# Altium schematic sheet 0090_USB3.SchDoc
size 848 x 558 mm
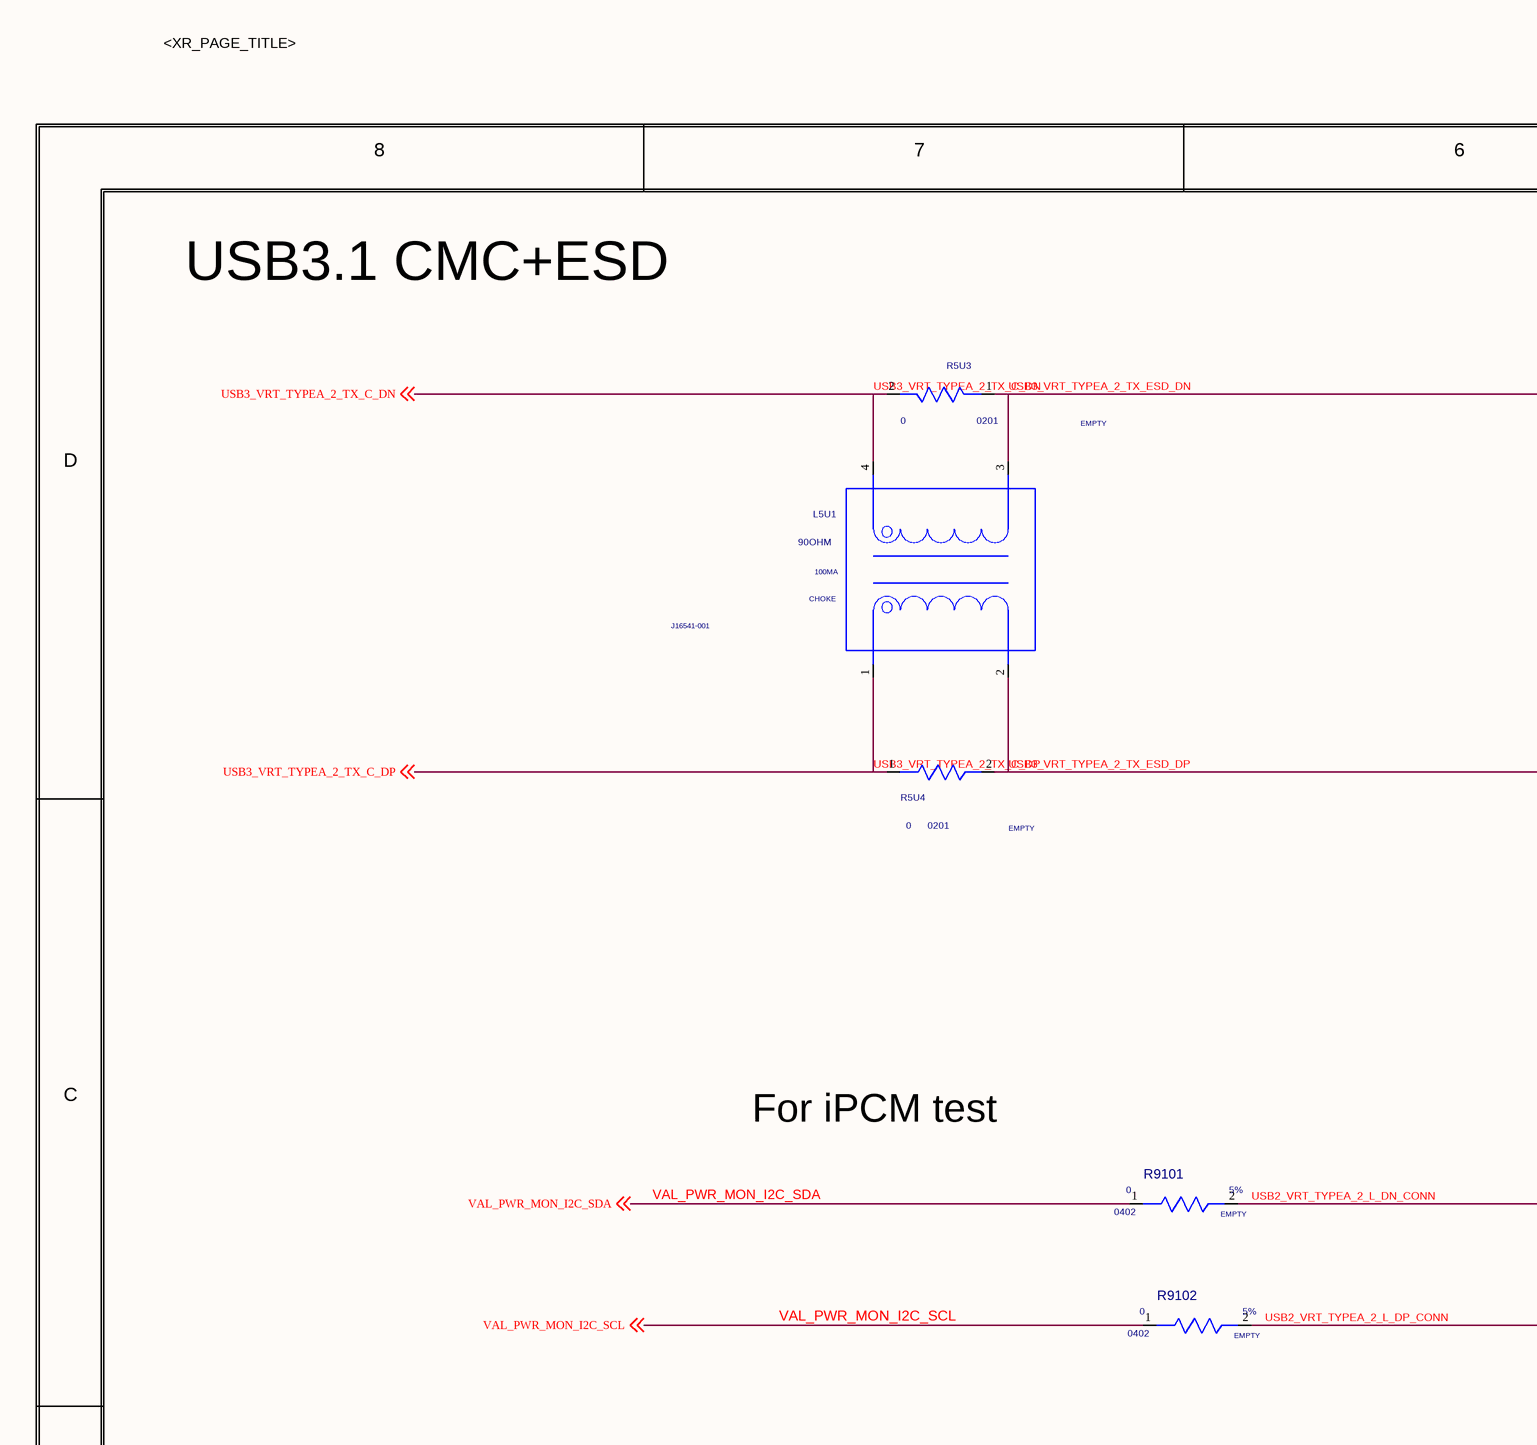
[diagram p0: 0090_USB3.SchDoc, top left]
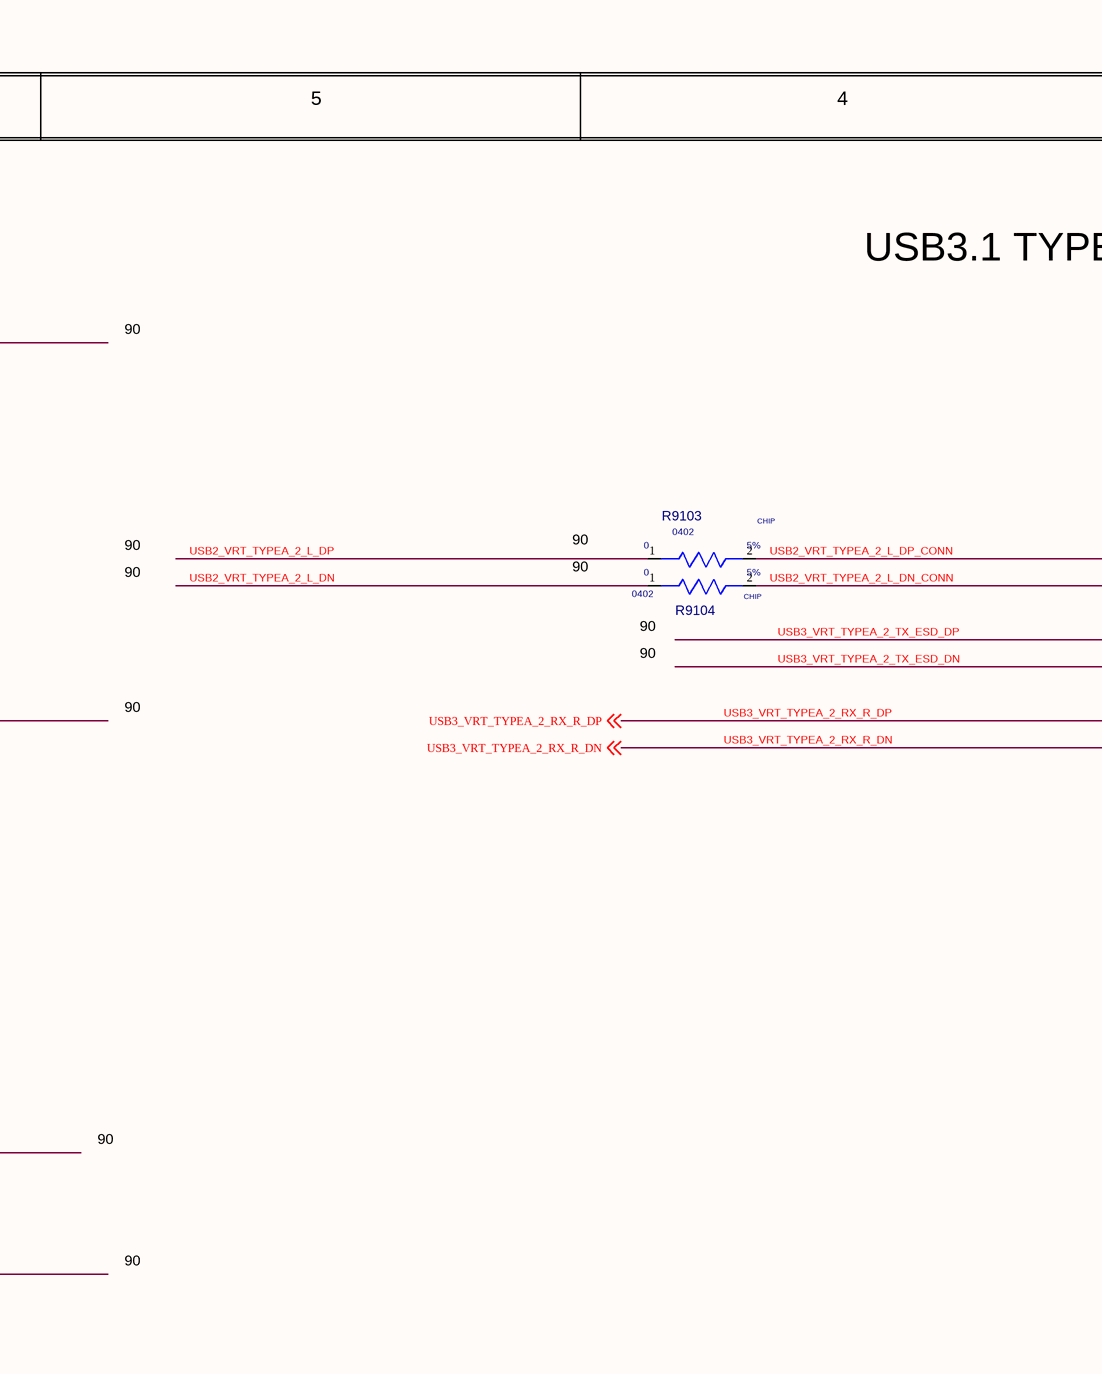
[diagram p1: 0090_USB3.SchDoc, top middle]
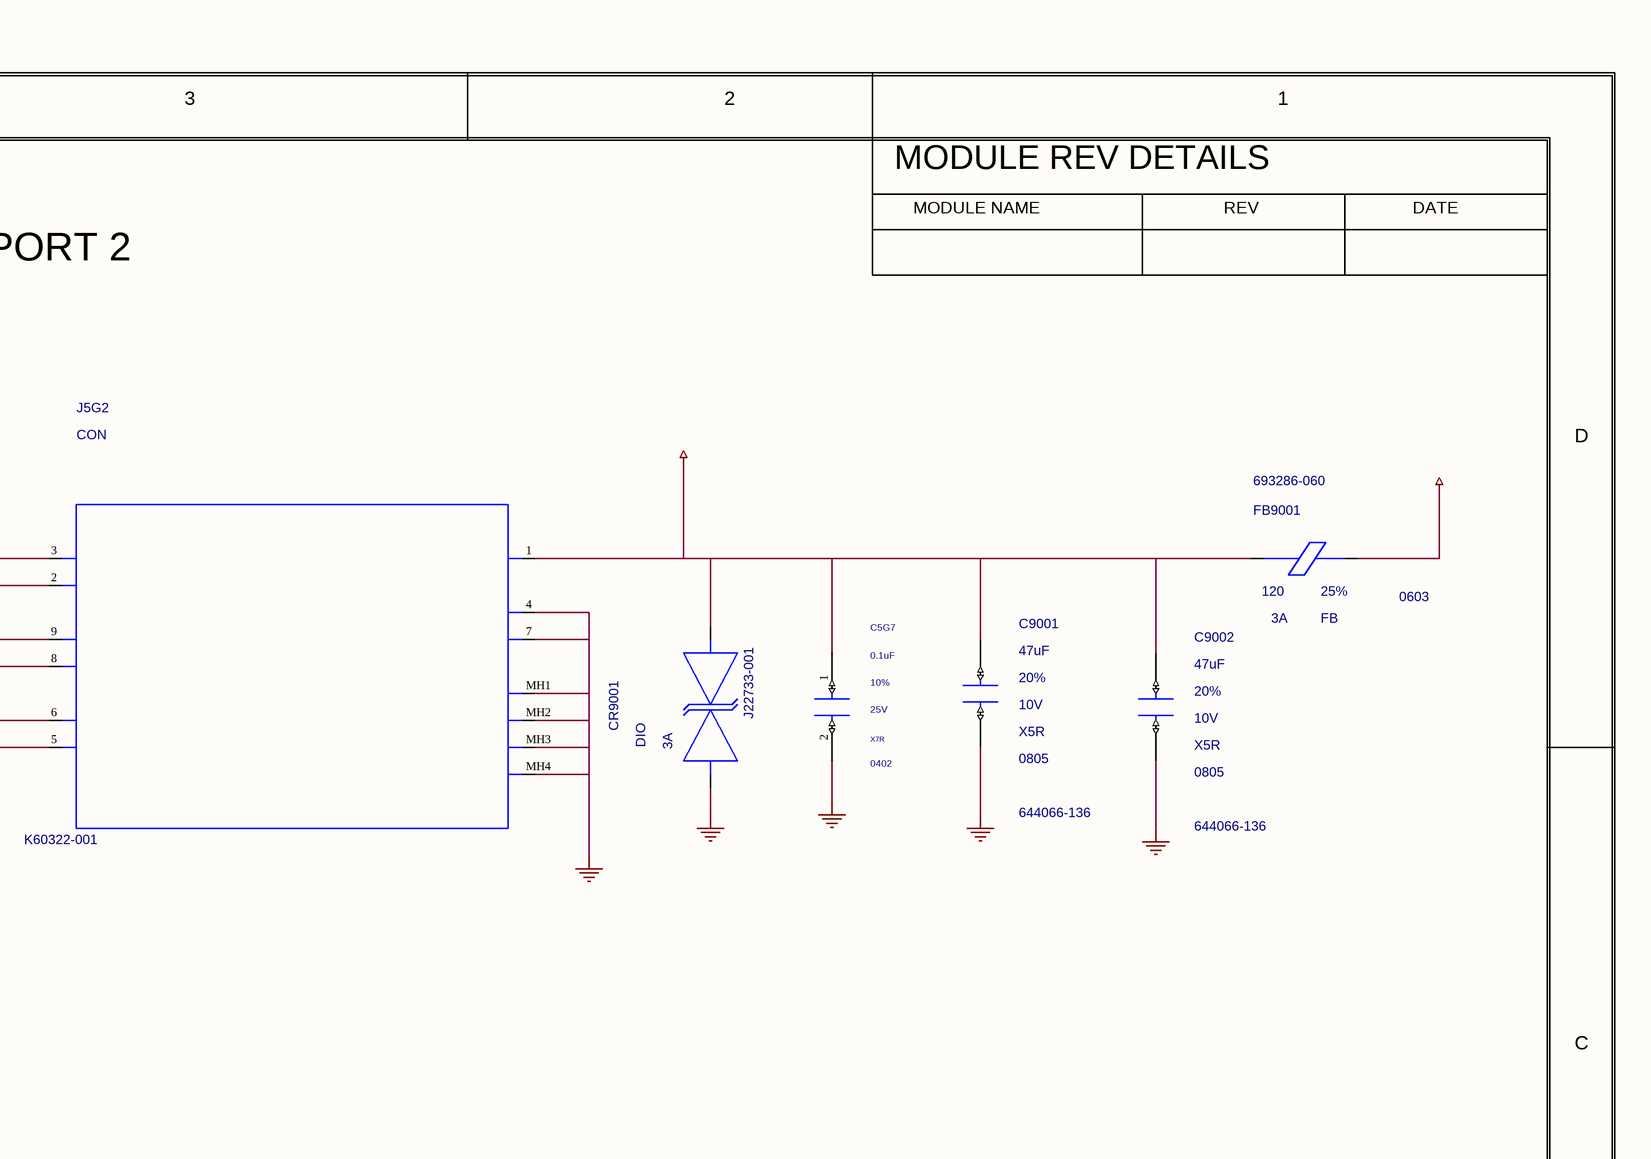
[diagram p2: 0090_USB3.SchDoc, top right]
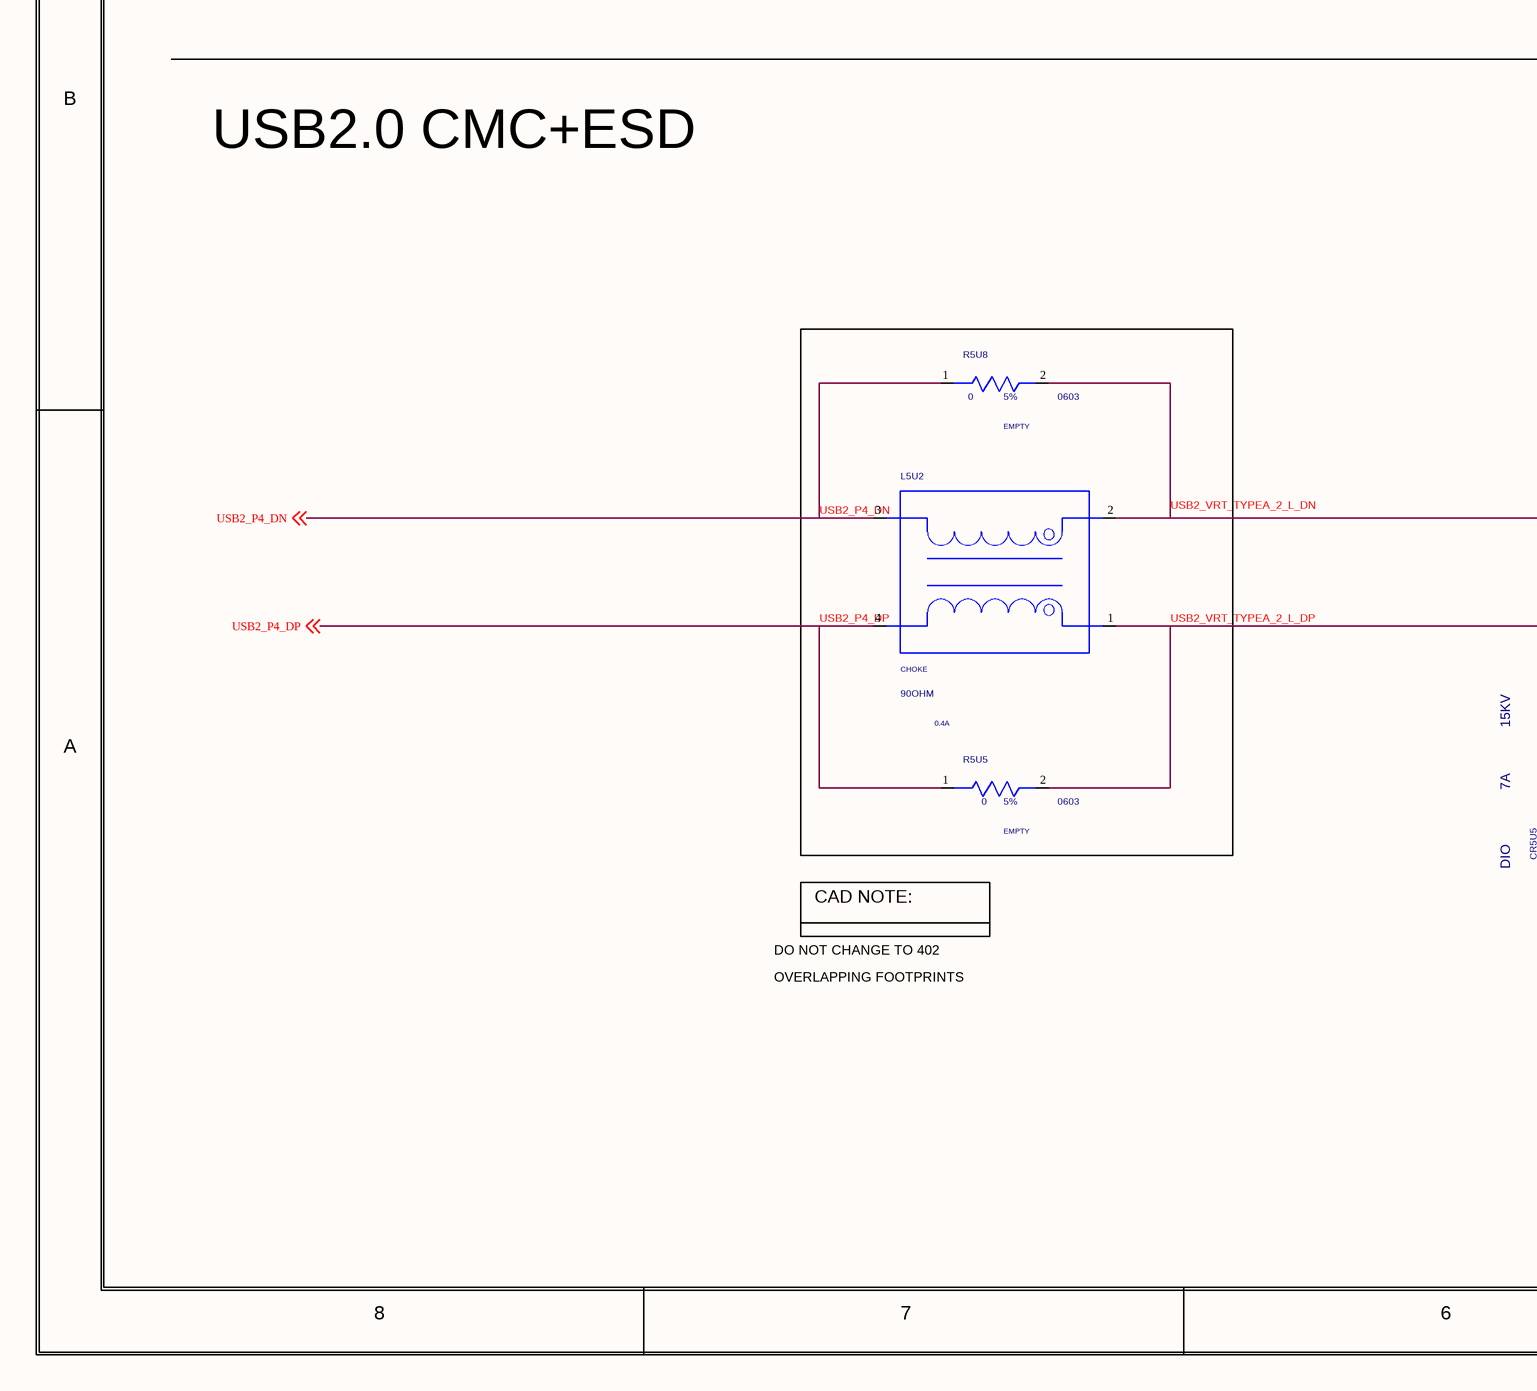
[diagram p3: 0090_USB3.SchDoc, bottom left]
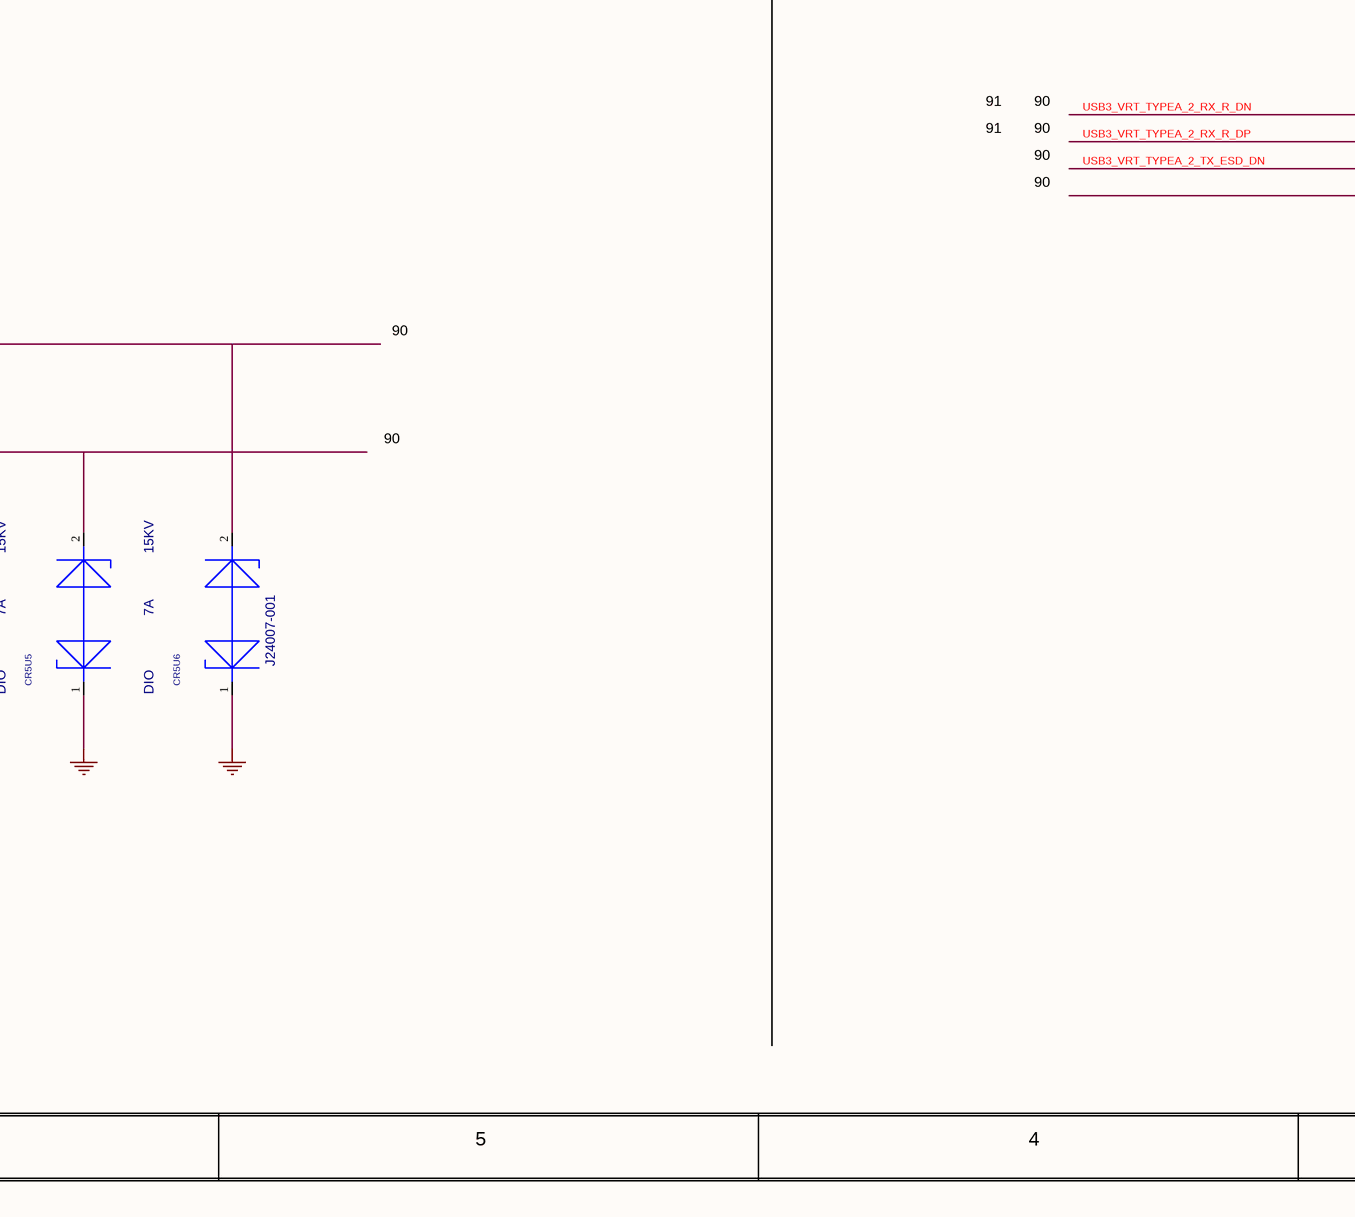
[diagram p4: 0090_USB3.SchDoc, bottom middle]
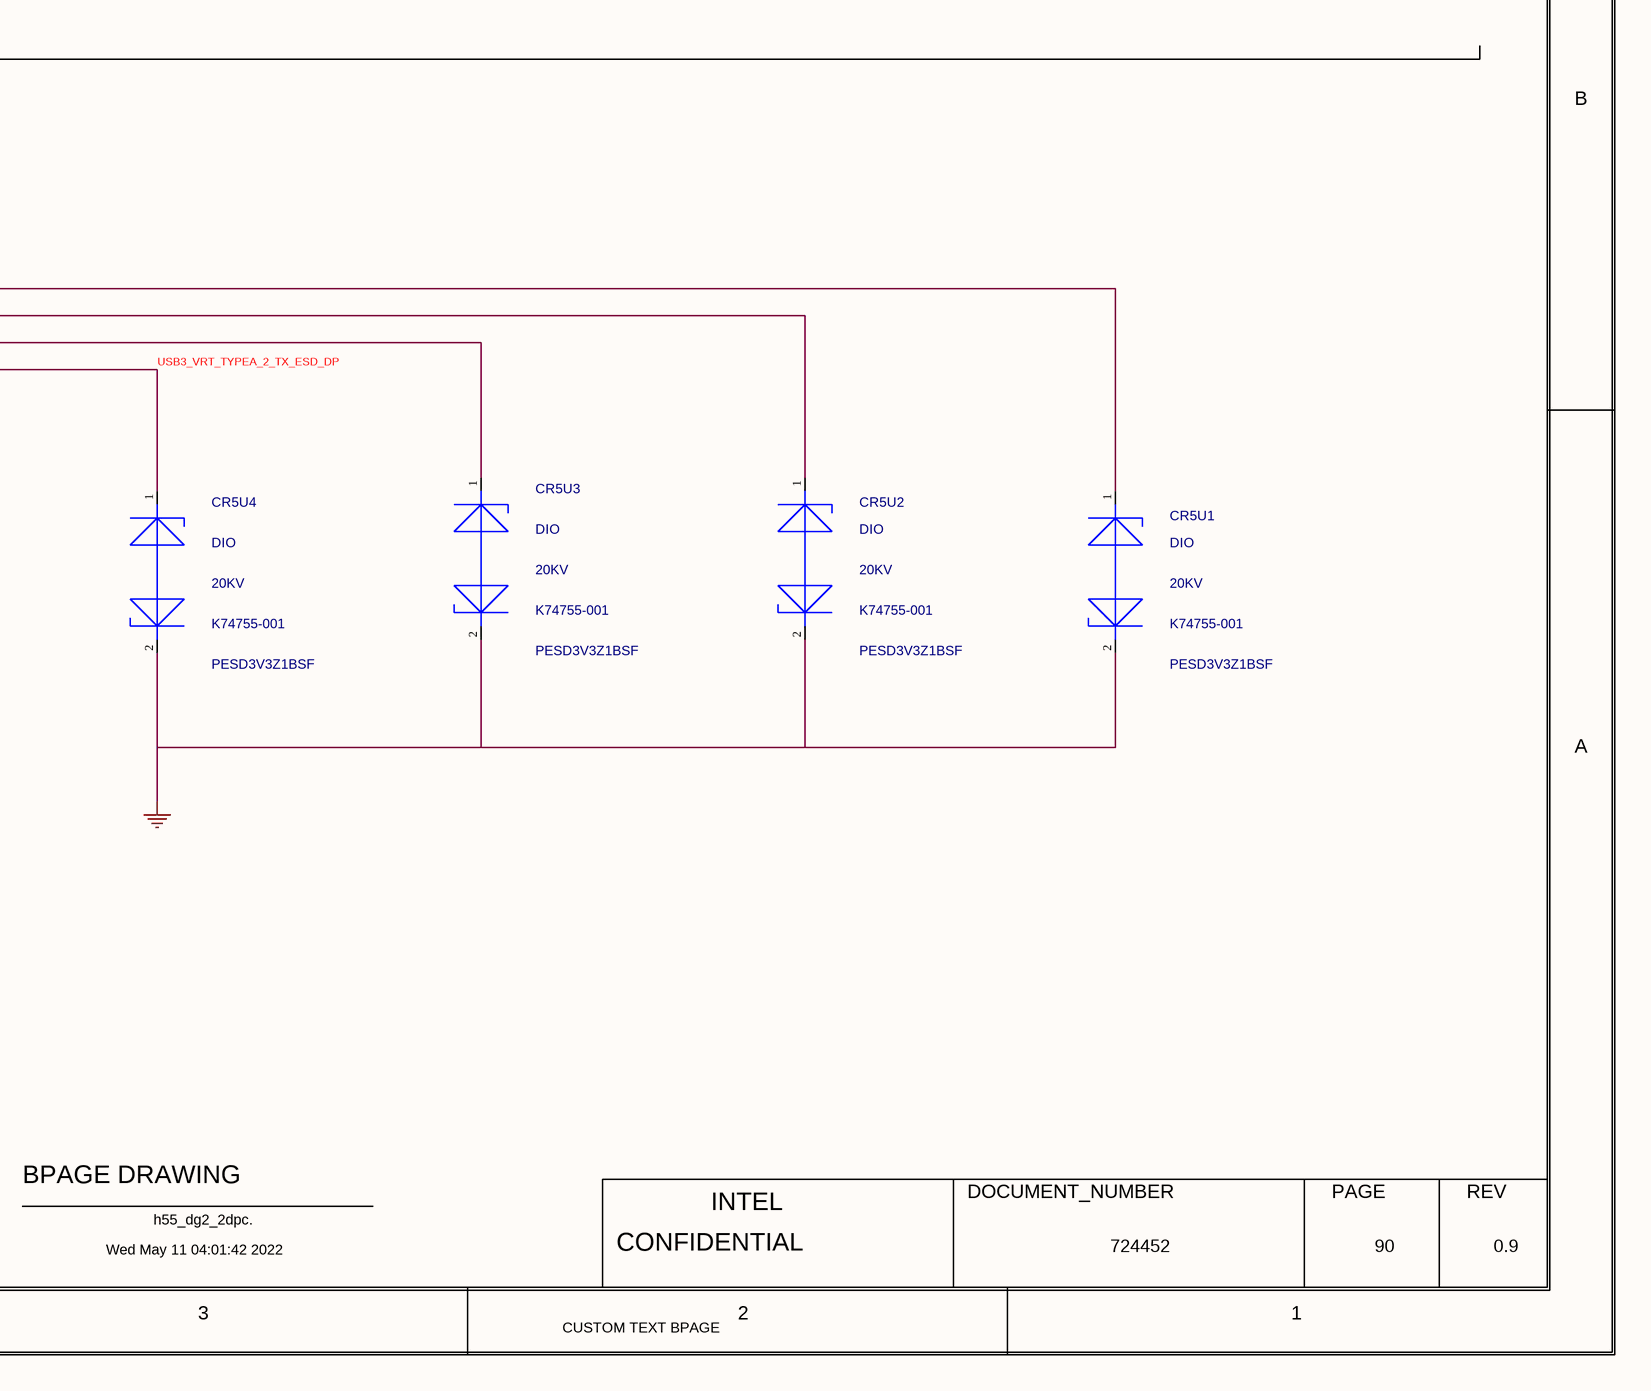
[diagram p5: 0090_USB3.SchDoc, bottom right]

## Parts
C5G7  0.1uF  MATERIAL: X7R  PACK_TYPE: 0402  TOLERANCE: 10%  VOLTAGE: 25V  [SMC0402IA]
C9001  47uF  MATERIAL: X5R  PACK_TYPE: 0805  PART_NUMBER: 644066-136  TOLERANCE: 20%  VOLTAGE: 10V  [CTK2_SM0805_2200X1450_MA]
C9002  47uF  MATERIAL: X5R  PACK_TYPE: 0805  PART_NUMBER: 644066-136  TOLERANCE: 20%  VOLTAGE: 10V  [CTK2_SM0805_2200X1450_MA]
CR5U1  PESD3V3Z1BSF  CURRENT: 20KV  MATERIAL: DIO  PART_NUMBER: K74755-001  [TK0_SCR_625X325_MB]
CR5U2  PESD3V3Z1BSF  CURRENT: 20KV  MATERIAL: DIO  PART_NUMBER: K74755-001  [TK0_SCR_625X325_MB]
CR5U3  PESD3V3Z1BSF  CURRENT: 20KV  MATERIAL: DIO  PART_NUMBER: K74755-001  [TK0_SCR_625X325_MB]
CR5U4  PESD3V3Z1BSF  CURRENT: 20KV  MATERIAL: DIO  PART_NUMBER: K74755-001  [TK0_SCR_625X325_MB]
CR5U5  15KV  CURRENT: 7A  MATERIAL: DIO  [TK0_SOD962_600X300_MA]
CR5U6  15KV  CURRENT: 7A  MATERIAL: DIO  PART_NUMBER: J24007-001  [TK0_SOD962_600X300_MA]
CR9001  CURRENT: 3A  MATERIAL: DIO  PART_NUMBER: J22733-001  [CTK2_SCR0201_610X310_MA]  (hidden comment: ESD200-B1-CSP0201)
FB9001  120  CURRENT: 3A  MATERIAL: FB  PACK_TYPE: 0603  PART_NUMBER: 693286-060  TOLERANCE: 25%  [CTK2_SM0603_1750X950_MA]
J5G2  MATERIAL: CON  PART_NUMBER: K60322-001  [CUSB3_MIDJR_9P_4EM_2000_MA_PIP_MR]  (hidden comment: C_USB3_TYPE_A_9P_4EM)
L5U1  90OHM  CURRENT: 100MA  MATERIAL: CHOKE  PART_NUMBER: J16541-001  [SMI4_50X65MA]
L5U2  90OHM  CURRENT: 0.4A  MATERIAL: CHOKE  [SMI4_79X47IA]
R5U3  0  MATERIAL: EMPTY  PACK_TYPE: 0201  [SMR0201IA]
R5U4  0  MATERIAL: EMPTY  PACK_TYPE: 0201  [SMR0201IA]
R5U5  0  MATERIAL: EMPTY  PACK_TYPE: 0603  TOLERANCE: 5%  [SMR0603IA]
R5U8  0  MATERIAL: EMPTY  PACK_TYPE: 0603  TOLERANCE: 5%  [SMR0603IA]
R9101  0  MATERIAL: EMPTY  PACK_TYPE: 0402  TOLERANCE: 5%  [SMR0402IA]
R9102  0  MATERIAL: EMPTY  PACK_TYPE: 0402  TOLERANCE: 5%  [SMR0402IA]
R9103  0  MATERIAL: CHIP  PACK_TYPE: 0402  TOLERANCE: 5%  [SMR0402IA]
R9104  0  MATERIAL: CHIP  PACK_TYPE: 0402  TOLERANCE: 5%  [SMR0402IA]

## Nets
+V5A_USB_P2: FB9001.2(B)
+V5A_USB_P2_FB: C5G7.1(A) C9001.1(A) C9002.1(A) CR9001.2(A2) FB9001.1(A) J5G2.1(VBUS_POWER)
GND: C5G7.2(B) C9001.2(B) C9002.2(B) CR5U1.2(K2) CR5U2.2(K2) CR5U3.2(K2) CR5U4.2(K2) CR5U5.1(K1) CR5U6.1(K1) CR9001.1(A1) J5G2.4(GND_POWER_RETURN) J5G2.7(GND) J5G2.MH1 J5G2.MH2 J5G2.MH3 J5G2.MH4
USB2_P4_DN: L5U2.3(IN_2) R5U8.1(A) ; off-sheet USB2_P4_DN
USB2_P4_DP: L5U2.4(OUT_1) R5U5.1(A) ; off-sheet USB2_P4_DP
USB2_VRT_TYPEA_2_L_DN: CR5U6.2(K2) L5U2.2(OUT_2) R5U8.2(B) R9104.1(A)
USB2_VRT_TYPEA_2_L_DN_CONN: J5G2.2(D_DN) R9101.2(B) R9104.2(B)
USB2_VRT_TYPEA_2_L_DP: CR5U5.2(K2) L5U2.1(IN_1) R5U5.2(B) R9103.1(A)
USB2_VRT_TYPEA_2_L_DP_CONN: J5G2.3(D_DP) R9102.2(B) R9103.2(B)
USB3_VRT_TYPEA_2_RX_R_DN: CR5U1.1(K1) J5G2.5(SSRX_DN) ; off-sheet USB3_VRT_TYPEA_2_RX_R_DN
USB3_VRT_TYPEA_2_RX_R_DP: CR5U2.1(K1) J5G2.6(SSRX_DP) ; off-sheet USB3_VRT_TYPEA_2_RX_R_DP
USB3_VRT_TYPEA_2_TX_C_DN: L5U1.4(PIN4) R5U3.2(B) ; off-sheet USB3_VRT_TYPEA_2_TX_C_DN
USB3_VRT_TYPEA_2_TX_C_DP: L5U1.1(PIN1) R5U4.1(A) ; off-sheet USB3_VRT_TYPEA_2_TX_C_DP
USB3_VRT_TYPEA_2_TX_ESD_DN: CR5U3.1(K1) J5G2.8(SSTX_DN) L5U1.3(PIN3) R5U3.1(A)
USB3_VRT_TYPEA_2_TX_ESD_DP: CR5U4.1(K1) J5G2.9(SSTX_DP) L5U1.2(PIN2) R5U4.2(B)
VAL_PWR_MON_I2C_SCL: R9102.1(A) ; off-sheet VAL_PWR_MON_I2C_SCL
VAL_PWR_MON_I2C_SDA: R9101.1(A) ; off-sheet VAL_PWR_MON_I2C_SDA

## Notes on the sheet
- <XR_PAGE_TITLE>
- 8
- 7
- 6
- 5
- 4
- 3
- 2
- 1
- MODULE REV DETAILS
- USB3.1 CMC+ESD
- USB3.1 TYPE-A  PORT 2
- MODULE NAME
- REV
- DATE
- 90
- D
- (near R9104) 90
- C
- For iPCM test
- B
- USB2.0 CMC+ESD
- 91
- A
- CAD NOTE:
- OVERLAPPING FOOTPRINTS
- DO NOT CHANGE TO 402
- BPAGE DRAWING
- INTEL
- DOCUMENT_NUMBER
- PAGE
- Wed May 11 04:01:42 2022
- h55_dg2_2dpc.
- CONFIDENTIAL
- 724452
- 0.9
- CUSTOM TEXT BPAGE

## Library data of the parts
C5G7 = CAP: PART_NUMBER: A36096-112; CDS_PHYS_PART_NAME: CAP_0402-A36096-112,X7R,0.1UF,25V,10%,LPDB,GENERIC; OriginalSymbolOrigin: (-50,25); XY: (-3350,3750); VER: 1; ROT: 0; PHYS_PAGE: 90; LOCATION: C5G7; IP: GENERIC; FP_TECH: LPDB; DRAWING: @RVP1_ADL_SB_ADP_S_DDR5_SODIMM_2DPC_LIB.H55_DG2_2DPC(SCH_1):PAGE461; CDS_LIB: discrete; PCB Footprint: SMC0402IA; SEC_TYPE: 0402; CHIPS_PART_NAME: CAP; CDS_PART_NAME: CAP_0402-A36096-112,X7R,0.1UF,25V,10%,LPDB,GENERIC; CDS_LOCATION: C5G7; ASI_MODEL: A36096-112
C9001 = C_CAP: CDS_PHYS_PART_NAME: C_CAP_0805-644066-136,X5R,47UF,10V,20%,TK2,GENERIC; CDS_LMAN_SYM_OUTLINE: -50,50,50,-50; FP_TECH: TK2; IP: GENERIC; ROOM: NONE; OriginalSymbolOrigin: (-50,25); XY: (-3075,3775); VER: 1; ROT: 0; PHYS_PAGE: 90; LOCATION: C9001; DRAWING: @RVP1_ADL_SB_ADP_S_DDR5_SODIMM_2DPC_LIB.H55_DG2_2DPC(SCH_1):PAGE461; CDS_LIB: c_discrete; VARIANT: ?; PCB Footprint: CTK2_SM0805_2200X1450_MA; CHIPS_PART_NAME: C_CAP; CDS_PART_NAME: C_CAP_0805-644066-136,X5R,47UF,10V,20%,TK2,GENERIC; CDS_LOCATION: C9001
C9002 = C_CAP: CDS_PHYS_PART_NAME: C_CAP_0805-644066-136,X5R,47UF,10V,20%,TK2,GENERIC; CDS_LMAN_SYM_OUTLINE: -50,50,50,-50; FP_TECH: TK2; IP: GENERIC; ROOM: NONE; OriginalSymbolOrigin: (-50,25); XY: (-2750,3750); VER: 1; ROT: 0; PHYS_PAGE: 90; LOCATION: C9002; DRAWING: @RVP1_ADL_SB_ADP_S_DDR5_SODIMM_2DPC_LIB.H55_DG2_2DPC(SCH_1):PAGE461; CDS_LIB: c_discrete; VARIANT: ?; PCB Footprint: CTK2_SM0805_2200X1450_MA; CHIPS_PART_NAME: C_CAP; CDS_PART_NAME: C_CAP_0805-644066-136,X5R,47UF,10V,20%,TK2,GENERIC; CDS_LOCATION: C9002
CR5U1 = DIODE_ESD_BIDIR_2: CDS_PHYS_PART_NAME: DIODE_ESD_BIDIR_2_SOD962-K74755-001,DIO,PESD3V3Z1BSF,20KV,TK0,GA; BOM_USE: STUFF; CDS_LMAN_SYM_OUTLINE: -150,150,150,-150; FP_TECH: TK0; IP: GENERIC; PACK_TYPE: SOD962; ROOM: NONE; OriginalSymbolOrigin: (-125,50); XY: (-2825,1125); VER: 1; ROT: 5; PHYS_PAGE: 90; LOCATION: CR5U1; DRAWING: @RVP1_ADL_SB_ADP_S_DDR5_SODIMM_2DPC_LIB.H55_DG2_2DPC(SCH_1):PAGE461; CDS_LIB: discrete_2; VARIANT: ?; PCB Footprint: TK0_SCR_625X325_MB; CHIPS_PART_NAME: DIODE_ESD_BIDIR_2; CDS_PART_NAME: DIODE_ESD_BIDIR_2_SOD962-K74755-001,DIO,PESD3V3Z1BSF,20KV,TK0,GA; CDS_LOCATION: CR5U1
CR5U2 = DIODE_ESD_BIDIR_2: CDS_PHYS_PART_NAME: DIODE_ESD_BIDIR_2_SOD962-K74755-001,DIO,PESD3V3Z1BSF,20KV,TK0,GA; BOM_USE: STUFF; CDS_LMAN_SYM_OUTLINE: -150,150,150,-150; FP_TECH: TK0; IP: GENERIC; PACK_TYPE: SOD962; ROOM: NONE; OriginalSymbolOrigin: (-125,50); XY: (-3400,1150); VER: 1; ROT: 5; PHYS_PAGE: 90; LOCATION: CR5U2; DRAWING: @RVP1_ADL_SB_ADP_S_DDR5_SODIMM_2DPC_LIB.H55_DG2_2DPC(SCH_1):PAGE461; CDS_LIB: discrete_2; VARIANT: ?; PCB Footprint: TK0_SCR_625X325_MB; CHIPS_PART_NAME: DIODE_ESD_BIDIR_2; CDS_PART_NAME: DIODE_ESD_BIDIR_2_SOD962-K74755-001,DIO,PESD3V3Z1BSF,20KV,TK0,GA; CDS_LOCATION: CR5U2
CR5U3 = DIODE_ESD_BIDIR_2: CDS_PHYS_PART_NAME: DIODE_ESD_BIDIR_2_SOD962-K74755-001,DIO,PESD3V3Z1BSF,20KV,TK0,GA; BOM_USE: STUFF; CDS_LMAN_SYM_OUTLINE: -150,150,150,-150; FP_TECH: TK0; IP: GENERIC; PACK_TYPE: SOD962; ROOM: NONE; OriginalSymbolOrigin: (-125,50); XY: (-4000,1150); VER: 1; ROT: 5; PHYS_PAGE: 90; LOCATION: CR5U3; DRAWING: @RVP1_ADL_SB_ADP_S_DDR5_SODIMM_2DPC_LIB.H55_DG2_2DPC(SCH_1):PAGE461; CDS_LIB: discrete_2; VARIANT: ?; PCB Footprint: TK0_SCR_625X325_MB; CHIPS_PART_NAME: DIODE_ESD_BIDIR_2; CDS_PART_NAME: DIODE_ESD_BIDIR_2_SOD962-K74755-001,DIO,PESD3V3Z1BSF,20KV,TK0,GA; CDS_LOCATION: CR5U3
CR5U4 = DIODE_ESD_BIDIR_2: CDS_PHYS_PART_NAME: DIODE_ESD_BIDIR_2_SOD962-K74755-001,DIO,PESD3V3Z1BSF,20KV,TK0,GA; BOM_USE: STUFF; CDS_LMAN_SYM_OUTLINE: -150,150,150,-150; FP_TECH: TK0; IP: GENERIC; PACK_TYPE: SOD962; ROOM: NONE; OriginalSymbolOrigin: (-125,50); XY: (-4600,1125); VER: 1; ROT: 5; PHYS_PAGE: 90; LOCATION: CR5U4; DRAWING: @RVP1_ADL_SB_ADP_S_DDR5_SODIMM_2DPC_LIB.H55_DG2_2DPC(SCH_1):PAGE461; CDS_LIB: discrete_2; VARIANT: ?; PCB Footprint: TK0_SCR_625X325_MB; CHIPS_PART_NAME: DIODE_ESD_BIDIR_2; CDS_PART_NAME: DIODE_ESD_BIDIR_2_SOD962-K74755-001,DIO,PESD3V3Z1BSF,20KV,TK0,GA; CDS_LOCATION: CR5U4
CR5U5 = DIODE_ESD_BIDIR_2: PART_NUMBER: J24007-001; CDS_PHYS_PART_NAME: DIODE_ESD_BIDIR_2_SOD962-J24007-001,DIO,15KV,7A,TK0,GENERIC; BOM_USE: STUFF; CDS_LMAN_SYM_OUTLINE: -150,150,150,-150; FP_TECH: TK0; IP: GENERIC; PACK_TYPE: SOD962; ROOM: NONE; OriginalSymbolOrigin: (-125,50); XY: (-7275,725); VER: 1; PHYS_PAGE: 90; LOCATION: CR5U5; DRAWING: @RVP1_ADL_SB_ADP_S_DDR5_SODIMM_2DPC_LIB.H55_DG2_2DPC(SCH_1):PAGE461; CDS_LIB: discrete_2; VARIANT: ?; PCB Footprint: TK0_SOD962_600X300_MA; ROT: 1; CHIPS_PART_NAME: DIODE_ESD_BIDIR_2; CDS_PART_NAME: DIODE_ESD_BIDIR_2_SOD962-J24007-001,DIO,15KV,7A,TK0,GENERIC; CDS_LOCATION: CR5U5; ASI_MODEL: J24007-001
CR5U6 = DIODE_ESD_BIDIR_2: CDS_PHYS_PART_NAME: DIODE_ESD_BIDIR_2_SOD962-J24007-001,DIO,15KV,7A,TK0,GENERIC; BOM_USE: STUFF; CDS_LMAN_SYM_OUTLINE: -150,150,150,-150; FP_TECH: TK0; IP: GENERIC; PACK_TYPE: SOD962; ROOM: NONE; OriginalSymbolOrigin: (-125,50); XY: (-7000,725); VER: 1; PHYS_PAGE: 90; LOCATION: CR5U6; DRAWING: @RVP1_ADL_SB_ADP_S_DDR5_SODIMM_2DPC_LIB.H55_DG2_2DPC(SCH_1):PAGE461; CDS_LIB: discrete_2; VARIANT: ?; PCB Footprint: TK0_SOD962_600X300_MA; ROT: 1; CHIPS_PART_NAME: DIODE_ESD_BIDIR_2; CDS_PART_NAME: DIODE_ESD_BIDIR_2_SOD962-J24007-001,DIO,15KV,7A,TK0,GENERIC; CDS_LOCATION: CR5U6; ASI_MODEL: J24007-001
CR9001 = C_DIODE_TVS: CDS_PHYS_PART_NAME: C_DIODE_TVS_SM-J22733-001,DIO,ESD200-B1-CSP0201,3A,TK2,GENERIC; CDS_LMAN_SYM_OUTLINE: -100,50,100,-50; FP_TECH: TK2; IP: GENERIC; PACK_TYPE: SM; ROOM: NONE; OriginalSymbolOrigin: (-125,50); XY: (-3575,3750); VER: 1; PHYS_PAGE: 90; LOCATION: CR9001; DRAWING: @RVP1_ADL_SB_ADP_S_DDR5_SODIMM_2DPC_LIB.H55_DG2_2DPC(SCH_1):PAGE461; CDS_LIB: local; VARIANT: ?; PCB Footprint: CTK2_SCR0201_610X310_MA; ROT: 1; CHIPS_PART_NAME: C_DIODE_TVS; CDS_PART_NAME: C_DIODE_TVS_SM-J22733-001,DIO,ESD200-B1-CSP0201,3A,TK2,GENERIC; CDS_LOCATION: CR9001
FB9001 = C_FERRITE: CDS_PHYS_PART_NAME: C_FERRITE_0603-693286-060,FB,120,25%,3A,TK2,GENERIC; CDS_LMAN_SYM_OUTLINE: -50,50,50,-50; FP_TECH: TK2; IP: GENERIC; ROOM: NONE; OriginalSymbolOrigin: (-75,50); XY: (-2475,4025); VER: 1; ROT: 0; PHYS_PAGE: 90; LOCATION: FB9001; DRAWING: @RVP1_ADL_SB_ADP_S_DDR5_SODIMM_2DPC_LIB.H55_DG2_2DPC(SCH_1):PAGE461; CDS_LIB: c_discrete; VARIANT: ?; PCB Footprint: CTK2_SM0603_1750X950_MA; CHIPS_PART_NAME: C_FERRITE; CDS_PART_NAME: C_FERRITE_0603-693286-060,FB,120,25%,3A,TK2,GENERIC; CDS_LOCATION: FB9001
J5G2 = C_USB3_TYPE_A_9P_4EM: CDS_PHYS_PART_NAME: C_USB3_TYPE_A_9P_4EM_TH-K60322-001,CON,USB3P1_GEN2_9P_4EM,TK0,GA; CDS_LMAN_SYM_OUTLINE: -400,300,400,-300; FP_TECH: TK0; IP: GENERIC; PACK_TYPE: TH; ROOM: NONE; OriginalSymbolOrigin: (-425,300); XY: (-4350,3825); VER: 1; ROT: 0; PHYS_PAGE: 90; LOCATION: J5G2; DRAWING: @RVP1_ADL_SB_ADP_S_DDR5_SODIMM_2DPC_LIB.H55_DG2_2DPC(SCH_1):PAGE461; CDS_LIB: local; VARIANT: ?; PCB Footprint: CUSB3_MIDJR_9P_4EM_2000_MA_PIP_MR; SEC_TYPE: TH; CHIPS_PART_NAME: C_USB3_TYPE_A_9P_4EM; CDS_PART_NAME: C_USB3_TYPE_A_9P_4EM_TH-K60322-001,CON,USB3P1_GEN2_9P_4EM,TK0,GA; CDS_LOCATION: J5G2
L5U1 = CHOKE_4P: CDS_PHYS_PART_NAME: CHOKE_4P_SM3-J16541-001,CHOKE,90OHM,NA,100MA,LPDB,GENERIC; CDS_LMAN_SYM_OUTLINE: -150,200,150,-150; PACK_TYPE: SM3; TOLERANCE: NA; OriginalSymbolOrigin: (-175,200); XY: (-8500,4100); VER: 10; ROT: 7; PHYS_PAGE: 90; LOCATION: L5U1; IP: GENERIC; FP_TECH: LPDB; DRAWING: @RVP1_ADL_SB_ADP_S_DDR5_SODIMM_2DPC_LIB.H55_DG2_2DPC(SCH_1):PAGE461; CDS_LIB: discrete; PCB Footprint: SMI4_50X65MA; SEC_TYPE: SM3; CHIPS_PART_NAME: CHOKE_4P; CDS_PART_NAME: CHOKE_4P_SM3-J16541-001,CHOKE,90OHM,NA,100MA,LPDB,GENERIC; CDS_LOCATION: L5U1; ASI_MODEL: J16541-001
L5U2 = IND_4PIN: PART_NUMBER: 752402-015; CDS_PHYS_PART_NAME: IND_4PIN_0805-752402-015,CHOKE,90OHM,NA,0.4A,LPDB,GENERIC; CDS_LMAN_SYM_OUTLINE: -200,150,150,-150; PACK_TYPE: 0805; TOLERANCE: NA; OriginalSymbolOrigin: (-225,150); XY: (-8410,1125); VER: 2; ROT: 4; PHYS_PAGE: 90; LOCATION: L5U2; IP: GENERIC; FP_TECH: LPDB; DRAWING: @RVP1_ADL_SB_ADP_S_DDR5_SODIMM_2DPC_LIB.H55_DG2_2DPC(SCH_1):PAGE461; CDS_LIB: discrete; PCB Footprint: SMI4_79X47IA; SEC_TYPE: 0805; CHIPS_PART_NAME: IND_4PIN; CDS_PART_NAME: IND_4PIN_0805-752402-015,CHOKE,90OHM,NA,0.4A,LPDB,GENERIC; CDS_LOCATION: L5U2; ASI_MODEL: 752402-015
R5U3 = RES#1: PART_NUMBER: C80792-009; CHIPS_PART_NAME: RES; CDS_PHYS_PART_NAME: RES_0201-C80792-009,EMPTY,0,5%,1/20W,LPDB,GENERIC; TOLERANCE: 5%; WATTAGE: 1/20W; OriginalSymbolOrigin: (-75,25); XY: (-8475,4425); VER: 1; ROT: 2; PHYS_PAGE: 90; LOCATION: R5U3; IP: GENERIC; FP_TECH: LPDB; FIN: USB_BPR; DRAWING: @RVP1_ADL_SB_ADP_S_DDR5_SODIMM_2DPC_LIB.H55_DG2_2DPC(SCH_1):PAGE461; CDS_LIB: discrete; PCB Footprint: SMR0201IA; SEC_TYPE: 0201; CDS_PART_NAME: RES_0201-C80792-009,EMPTY,0,5%,1/20W,LPDB,GENERIC; CDS_LOCATION: R5U3; ASI_MODEL: C80792-009
R5U4 = RES#1: PART_NUMBER: C80792-009; CHIPS_PART_NAME: RES; CDS_PHYS_PART_NAME: RES_0201-C80792-009,EMPTY,0,5%,1/20W,LPDB,GENERIC; TOLERANCE: 5%; WATTAGE: 1/20W; OriginalSymbolOrigin: (-75,25); XY: (-8475,3725); VER: 1; PHYS_PAGE: 90; LOCATION: R5U4; IP: GENERIC; FP_TECH: LPDB; FIN: USB_BPR; DRAWING: @RVP1_ADL_SB_ADP_S_DDR5_SODIMM_2DPC_LIB.H55_DG2_2DPC(SCH_1):PAGE461; CDS_LIB: discrete; PCB Footprint: SMR0201IA; SEC_TYPE: 0201; ROT: 0; CDS_PART_NAME: RES_0201-C80792-009,EMPTY,0,5%,1/20W,LPDB,GENERIC; CDS_LOCATION: R5U4; ASI_MODEL: C80792-009
R5U5 = RES#1: PART_NUMBER: A93552-004; CHIPS_PART_NAME: RES; CDS_PHYS_PART_NAME: RES_0603-A93552-004,EMPTY,0,5%,1/10W,LPDB,GENERIC; WATTAGE: 1/10W; OriginalSymbolOrigin: (-75,25); XY: (-8385,725); VER: 1; PHYS_PAGE: 90; LOCATION: R5U5; IP: GENERIC; FP_TECH: LPDB; FIN: USB_BPR; DRAWING: @RVP1_ADL_SB_ADP_S_DDR5_SODIMM_2DPC_LIB.H55_DG2_2DPC(SCH_1):PAGE461; CDS_LIB: discrete; BOM: BP_USB_DUAL; PCB Footprint: SMR0603IA; SEC_TYPE: 0603; ROT: 0; CDS_PART_NAME: RES_0603-A93552-004,EMPTY,0,5%,1/10W,LPDB,GENERIC; CDS_LOCATION: R5U5; ASI_MODEL: A93552-004
R5U8 = RES#1: PART_NUMBER: A93552-004; CHIPS_PART_NAME: RES; CDS_PHYS_PART_NAME: RES_0603-A93552-004,EMPTY,0,5%,1/10W,LPDB,GENERIC; WATTAGE: 1/10W; OriginalSymbolOrigin: (-75,25); XY: (-8385,1475); VER: 1; PHYS_PAGE: 90; LOCATION: R5U8; IP: GENERIC; FP_TECH: LPDB; FIN: USB_BPR; DRAWING: @RVP1_ADL_SB_ADP_S_DDR5_SODIMM_2DPC_LIB.H55_DG2_2DPC(SCH_1):PAGE461; CDS_LIB: discrete; BOM: BP_USB_DUAL; PCB Footprint: SMR0603IA; ROT: 0; CDS_PART_NAME: RES_0603-A93552-004,EMPTY,0,5%,1/10W,LPDB,GENERIC; CDS_LOCATION: R5U8; ASI_MODEL: A93552-004
R9101 = RES#1: PART_NUMBER: A93549-001; CHIPS_PART_NAME: RES; CDS_PHYS_PART_NAME: RES_0402-A93549-001,EMPTY,0,5%,1/16W,LPDB,GENERIC; WATTAGE: 1/16W; OriginalSymbolOrigin: (-75,25); XY: (-8025,2925); VER: 1; PHYS_PAGE: 90; LOCATION: R9101; IP: GENERIC; FP_TECH: LPDB; FIN: LAN; DRAWING: @RVP1_ADL_SB_ADP_S_DDR5_SODIMM_2DPC_LIB.H55_DG2_2DPC(SCH_1):PAGE461; CDS_LIB: discrete; PCB Footprint: SMR0402IA; ROT: 0; CDS_PART_NAME: RES_0402-A93549-001,EMPTY,0,5%,1/16W,LPDB,GENERIC; CDS_LOCATION: R9101; BOM: LAN; ASI_MODEL: A93549-001
R9102 = RES#1: PART_NUMBER: A93549-001; CHIPS_PART_NAME: RES; CDS_PHYS_PART_NAME: RES_0402-A93549-001,EMPTY,0,5%,1/16W,LPDB,GENERIC; WATTAGE: 1/16W; OriginalSymbolOrigin: (-75,25); XY: (-8000,2700); VER: 1; PHYS_PAGE: 90; LOCATION: R9102; IP: GENERIC; FP_TECH: LPDB; FIN: LAN; DRAWING: @RVP1_ADL_SB_ADP_S_DDR5_SODIMM_2DPC_LIB.H55_DG2_2DPC(SCH_1):PAGE461; CDS_LIB: discrete; PCB Footprint: SMR0402IA; ROT: 0; CDS_PART_NAME: RES_0402-A93549-001,EMPTY,0,5%,1/16W,LPDB,GENERIC; CDS_LOCATION: R9102; BOM: LAN; ASI_MODEL: A93549-001
R9103 = RES#1: PART_NUMBER: A93549-001; CHIPS_PART_NAME: RES; CDS_PHYS_PART_NAME: RES_0402-A93549-001,CHIP,0,5%,1/16W,LPDB,GENERIC; WATTAGE: 1/16W; OriginalSymbolOrigin: (-75,25); XY: (-5800,4025); VER: 1; PHYS_PAGE: 90; LOCATION: R9103; IP: GENERIC; FP_TECH: LPDB; FIN: LAN; DRAWING: @RVP1_ADL_SB_ADP_S_DDR5_SODIMM_2DPC_LIB.H55_DG2_2DPC(SCH_1):PAGE461; CDS_LIB: discrete; PCB Footprint: SMR0402IA; ROT: 0; CDS_PART_NAME: RES_0402-A93549-001,CHIP,0,5%,1/16W,LPDB,GENERIC; CDS_LOCATION: R9103; BOM: LAN; ASI_MODEL: A93549-001
R9104 = RES#1: PART_NUMBER: A93549-001; CHIPS_PART_NAME: RES; CDS_PHYS_PART_NAME: RES_0402-A93549-001,CHIP,0,5%,1/16W,LPDB,GENERIC; WATTAGE: 1/16W; OriginalSymbolOrigin: (-75,25); XY: (-5800,3975); VER: 1; PHYS_PAGE: 90; LOCATION: R9104; IP: GENERIC; FP_TECH: LPDB; FIN: LAN; DRAWING: @RVP1_ADL_SB_ADP_S_DDR5_SODIMM_2DPC_LIB.H55_DG2_2DPC(SCH_1):PAGE461; CDS_LIB: discrete; PCB Footprint: SMR0402IA; ROT: 0; CDS_PART_NAME: RES_0402-A93549-001,CHIP,0,5%,1/16W,LPDB,GENERIC; CDS_LOCATION: R9104; BOM: LAN; ASI_MODEL: A93549-001